# EAGLE schematic TS_OD (EAGLE 7.2.0)
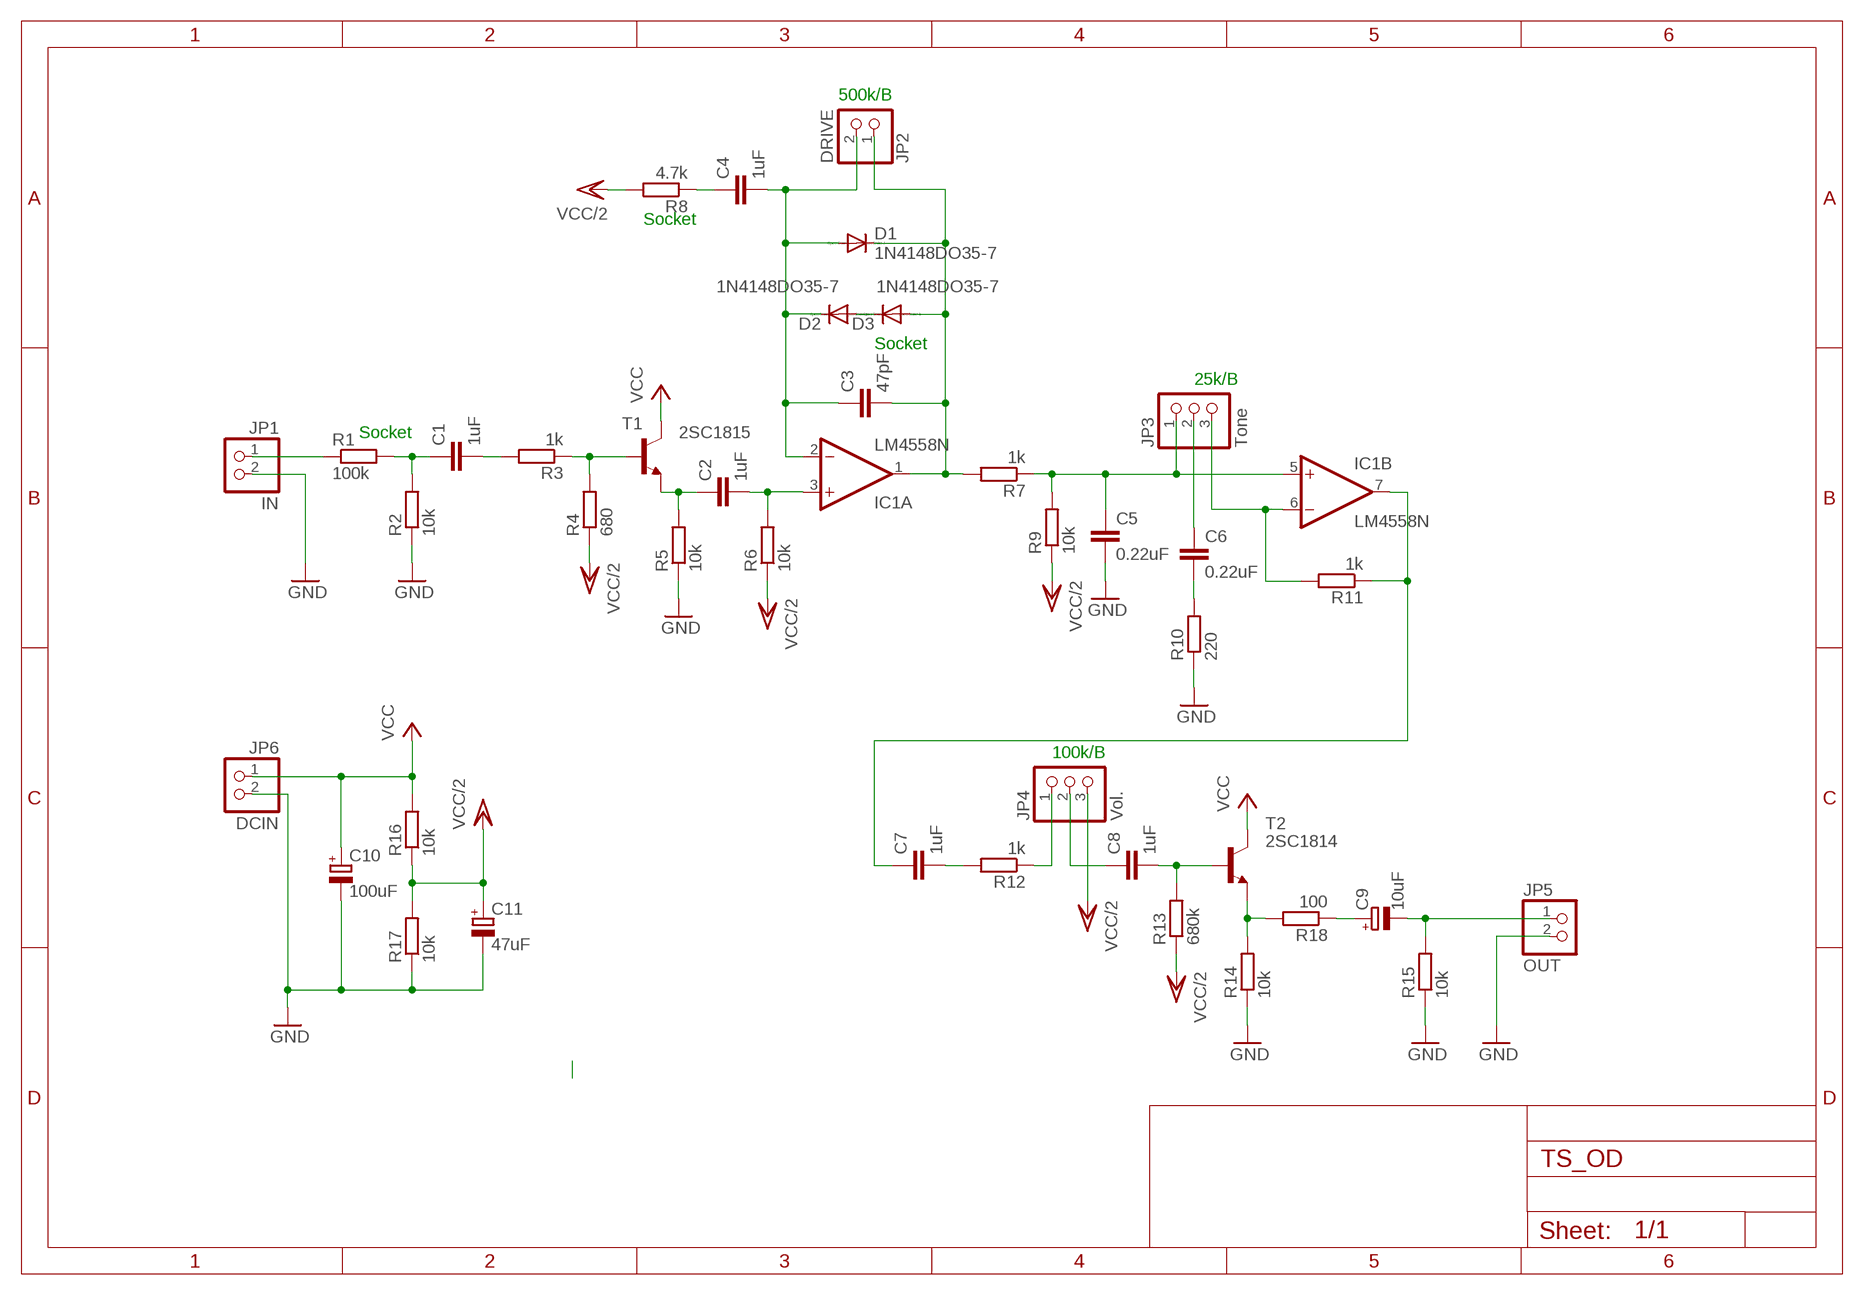
[diagram p0: schematic, sheet 1]

## Parts
C1  1uF  C-EU050-050X075  [C050-050X075]
C2  1uF  C-EU050-050X075  [C050-050X075]
C3  47pF  C-EU050-024X044  [C050-024X044]
C4  1uF  C-EU050-050X075  [C050-050X075]
C5  0.22uF  C-EU050-035X075  [C050-035X075]
C6  0.22uF  C-EU050-035X075  [C050-035X075]
C7  1uF  C-EU050-050X075  [C050-050X075]
C8  1uF  C-EU050-050X075  [C050-050X075]
C9  10uF  CPOL-EUE2.5-5  [E2,5-5]
C10  100uF  CPOL-EUE2.5-7  [E2,5-7]
C11  47uF  CPOL-EUE2.5-7  [E2,5-7]
D1  1N4148DO35-7  [DO35-7]
D2  1N4148DO35-7  [DO35-7]
D3  1N4148DO35-7  [DO35-7]
IC1  LM4558N  [DIL08]
JP1  IN  PINHD-1X2  [1X02]
JP2  DRIVE  PINHD-1X2  [1X02]
JP3  Tone  PINHD-1X3  [1X03]
JP4  Vol.  PINHD-1X3  [1X03]
JP5  OUT  PINHD-1X2  [1X02]
JP6  DCIN  PINHD-1X2  [1X02]
R1  100k  R-EU_0207/7  [0207/7]
R2  10k  R-EU_0207/7  [0207/7]
R3  1k  R-EU_0207/7  [0207/7]
R4  680  R-EU_0207/7  [0207/7]
R5  10k  R-EU_0207/7  [0207/7]
R6  10k  R-EU_0207/7  [0207/7]
R7  1k  R-EU_0207/7  [0207/7]
R8  4.7k  R-EU_0207/7  [0207/7]
R9  10k  R-EU_0207/7  [0207/7]
R10  220  R-EU_0207/7  [0207/7]
R11  1k  R-EU_0207/7  [0207/7]
R12  1k  R-EU_0207/7  [0207/7]
R13  680k  R-EU_0207/7  [0207/7]
R14  10k  R-EU_0207/7  [0207/7]
R15  10k  R-EU_0207/7  [0207/7]
R16  10k  R-EU_0207/7  [0207/7]
R17  10k  R-EU_0207/7  [0207/7]
R18  100  R-EU_0207/7  [0207/7]
T1  2SC1815  -NPN-TO92-ECB  [TO92-ECB]
T2  2SC1814  -NPN-TO92-ECB  [TO92-ECB]

## Nets
GND: C5.2 C10.- C11.- JP1.2 JP5.2 JP6.2 R2.1 R5.1 R10.1 R14.1 R15.1 R17.1
N$1: JP1.1 R1.1
N$2: C1.1 R1.2 R2.2
N$3: C1.2 R3.2
N$4: C5.1 IC1.5(B:+IN) JP3.1 R7.1 R9.2
N$5: R3.1 R4.2 T1.B
N$6: C2.1 R5.2 T1.E
N$7: C2.2 IC1.3(A:+IN) R6.2
N$8: C3.1 C4.2 D1.A D2.C IC1.2(A:-IN) JP2.2
N$9: D2.A D3.C
N$10: C3.2 D1.C D3.A IC1.1(A:OUT) JP2.1 R7.2
N$11: C4.1 R8.1
N$12: IC1.6(B:-IN) JP3.3 R11.2
N$13: C6.2 R10.2
N$14: C6.1 JP3.2
N$15: C7.1 IC1.7(B:OUT) R11.1
N$16: C7.2 R12.2
N$17: JP4.1 R12.1
N$18: C8.1 JP4.2
N$19: C8.2 R13.2 T2.B
N$20: R14.2 R18.2 T2.E
N$21: C9.- JP5.1 R15.2
N$22: C9.+ R18.1
VCC: C10.+ JP6.1 R16.2 T1.C T2.C
VCC/2: C11.+ JP4.3 R4.1 R6.1 R8.2 R9.1 R13.1 R16.1 R17.2

## Notes on the sheet
- 500k/B
- Socket
- Socket
- 25k/B
- Socket
- 100k/B

## Power pins joined to a net without a drawn wire
V+: IC1.8(P:V+)
V-: IC1.4(P:V-)

## Library data of the parts
C1-C8 = rcl:C-EU: CAPACITOR, European symbol
C9-C11 = rcl:CPOL-EU: POLARIZED CAPACITOR, European symbol
D1-D3 = diode:1N4148: DIODE high speed (Philips)
IC1 = linear:*4558: OP AMP
JP1 JP2 JP5 JP6 = pinhead:PINHD-1X2: PIN HEADER
JP3 JP4 = pinhead:PINHD-1X3: PIN HEADER
R1-R18 = rcl:R-EU_: RESISTOR, European symbol
T1 T2 = transistor:*-NPN-: NPN Transistror BF959 corrected 2008.03.06